# EAGLE schematic ESP8266 MegaD adapter board v0.1 (EAGLE 7.5.0)
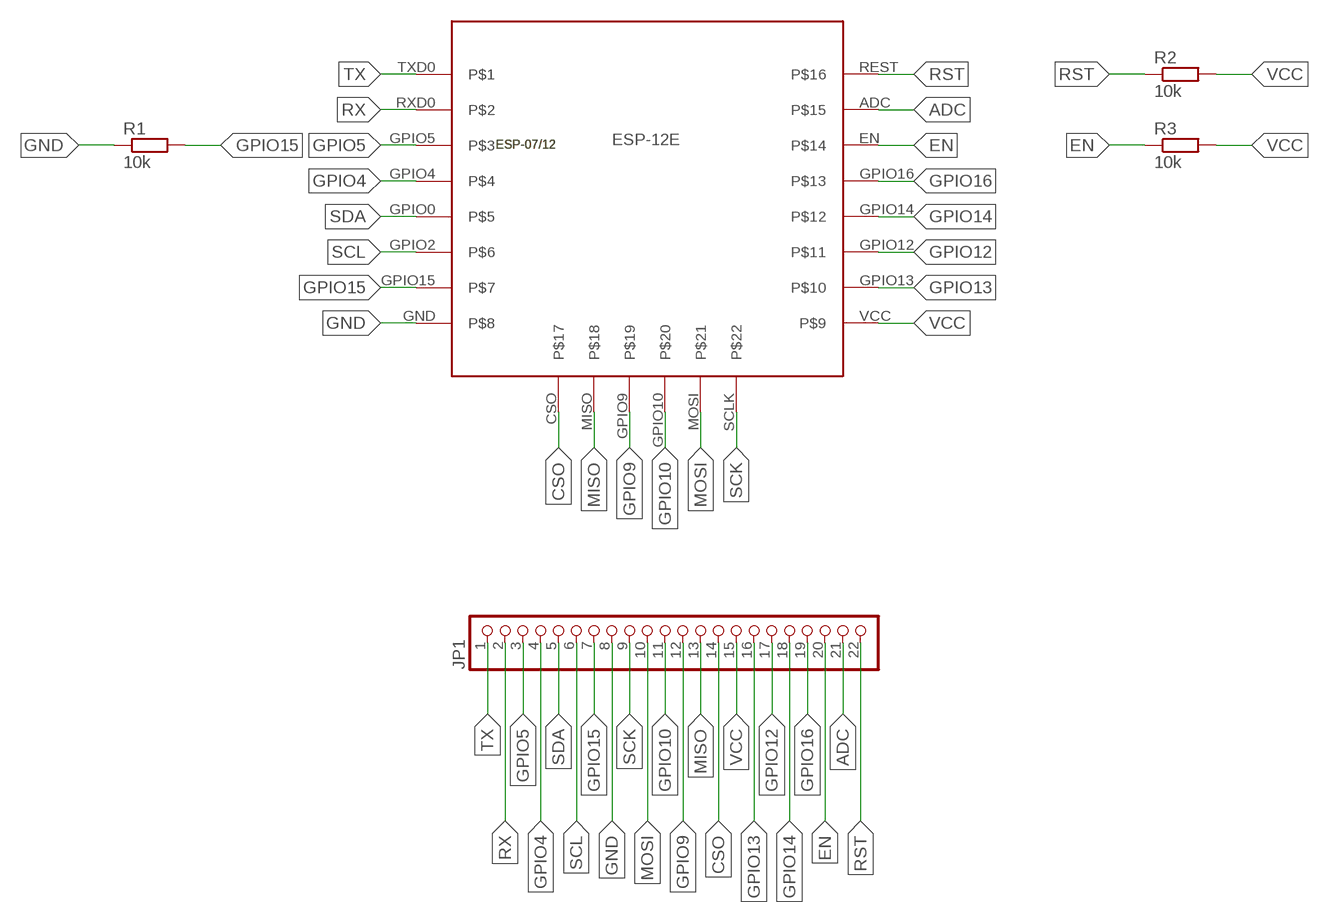
[diagram p0: schematic, sheet 1]

## Parts
JP1  PINHD-1X22  [1X22]
R1  10k  R-EU_R1206  [R1206]
R2  10k  R-EU_R1206  [R1206]
R3  10k  R-EU_R1206  [R1206]
U$3  ESP-07/12_ESP-12E  [ESP-07/12]

## Nets
ADC: JP1.21 U$3.ADC
CSO: JP1.14 U$3.CSO
EN: JP1.20 R3.1 U$3.EN
GND: JP1.8 R1.1 U$3.GND
GPIO4: JP1.4 U$3.GPIO4
GPIO5: JP1.3 U$3.GPIO5
GPIO9: JP1.12 U$3.GPIO9
GPIO10: JP1.11 U$3.GPIO10
GPIO12: JP1.17 U$3.GPIO12
GPIO13: JP1.16 U$3.GPIO13
GPIO14: JP1.18 U$3.GPIO14
GPIO15: JP1.7 R1.2 U$3.GPIO15
GPIO16: JP1.19 U$3.GPIO16
MISO: JP1.13 U$3.MISO
MOSI: JP1.10 U$3.MOSI
RST: JP1.22 R2.1 U$3.REST
RX: JP1.2 U$3.RXD0
SCK: JP1.9 U$3.SCLK
SCL: JP1.6 U$3.GPIO2
SDA: JP1.5 U$3.GPIO0
TX: JP1.1 U$3.TXD0
VCC: JP1.15 R2.2 R3.2 U$3.VCC

## Library data of the parts
JP1 = pinhead:PINHD-1X22: PIN HEADER
R1-R3 = rcl:R-EU_: RESISTOR, European symbol
U$3 = ESP-12E:ESP-07/12: Version 1.0 of the library for the ESP-07/12 full GPIO dev board module byME Jon jonnyradu@gmail.com